# Altium schematic sheet main.SchDoc
size A3
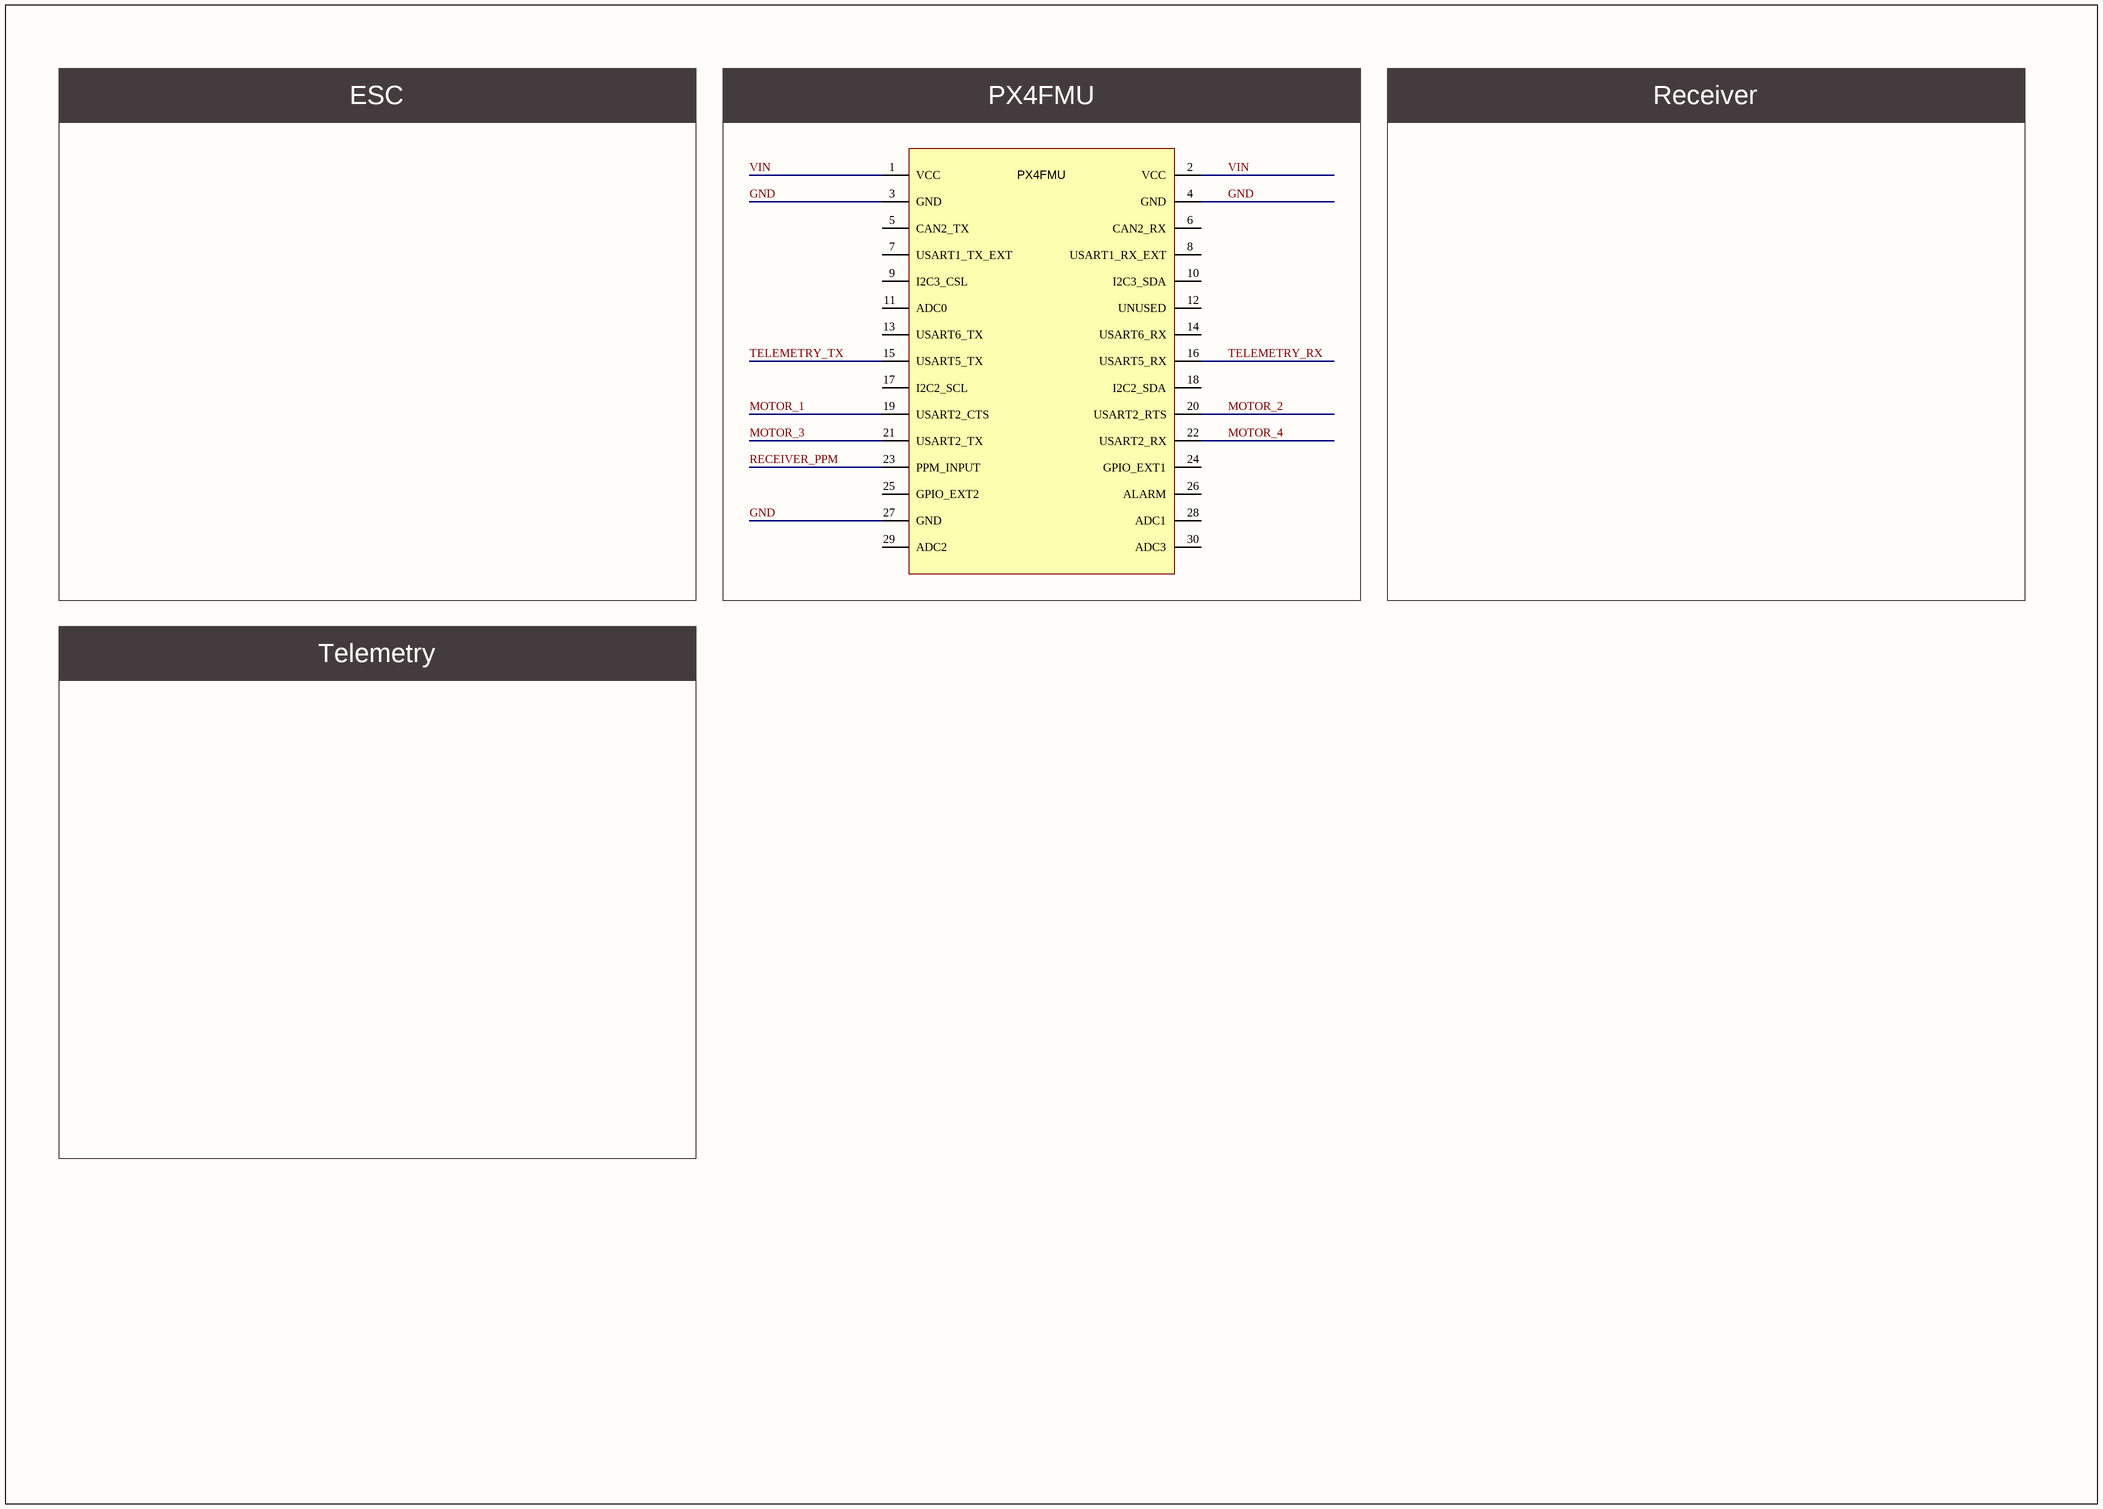
[diagram p0: main.SchDoc]

## Parts
PX4FMU  PX4FMU  (value not drawn)

## Blocks framed on the sheet
PX4FMU: PX4FMU

## Nets
GND: PX4FMU.3(GND) PX4FMU.4(GND) PX4FMU.27(GND)
MOTOR_1: PX4FMU.19(USART2_CTS)
MOTOR_2: PX4FMU.20(USART2_RTS)
MOTOR_3: PX4FMU.21(USART2_TX)
MOTOR_4: PX4FMU.22(USART2_RX)
RECEIVER_PPM: PX4FMU.23(PPM_INPUT)
TELEMETRY_RX: PX4FMU.16(USART5_RX)
TELEMETRY_TX: PX4FMU.15(USART5_TX)
VIN: PX4FMU.1(VCC) PX4FMU.2(VCC)

Not connected (* = marked no-connect by the designer): PX4FMU 5(CAN2_TX) 6(CAN2_RX) 7(USART1_TX_EXT) 8(USART1_RX_EXT) 9(I2C3_CSL) 10(I2C3_SDA) 11(ADC0) 12(UNUSED) 13(USART6_TX) 14(USART6_RX) 17(I2C2_SCL) 18(I2C2_SDA) 24(GPIO_EXT1) 25(GPIO_EXT2) 26(ALARM) 28(ADC1) 29(ADC2) 30(ADC3)

## Notes on the sheet
- ESC
- Receiver
- Telemetry

## Library data of the parts
PX4FMU = PX4FMU: PX4FMU flight controller